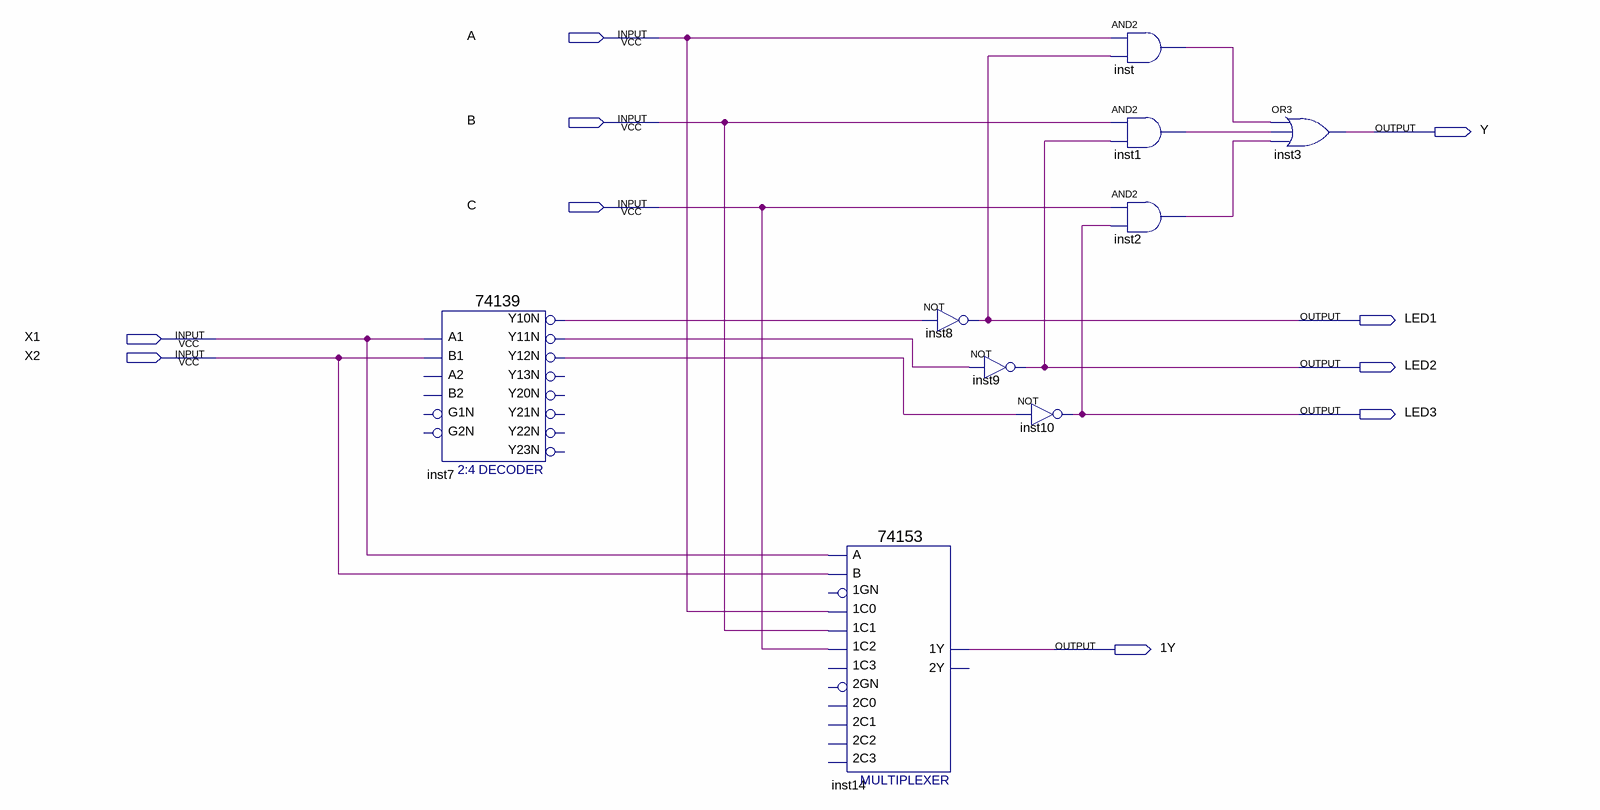
[diagram p0: schematic sheet]
// Quartus schematic Cmb3.bdf as structural Verilog: 9 symbols, 10 pins
module Cmb3 (
  input  A,
  input  B,
  input  C,
  input  X1,
  input  X2,
  output Y,
  output LED1,
  output LED2,
  output LED3,
  output \1Y 
);

  wire inst1_out, inst2_out, inst7_y10n, inst7_y11n, inst7_y12n, inst_out;

  \74139  inst7 (
    .A1(X1), .B1(X2), .Y10N(inst7_y10n), .Y12N(inst7_y12n), .Y11N(inst7_y11n));  // open: A2, B2, G1N, G2N, Y20N, Y13N, Y21N, Y22N, Y23N
  \74153  inst14 (
    .\1C1 (B), .\1C0 (A), .\1C2 (C), .B(X2), .A(X1), .\1Y (\1Y ));  // open: 1GN, 2C0, 2GN, 2C2, 1C3, 2C1, 2C3, 2Y
  not inst8 (LED1, inst7_y10n);
  not inst9 (LED2, inst7_y11n);
  not inst10 (LED3, inst7_y12n);
  and inst (inst_out, A, LED1);
  and inst1 (inst1_out, B, LED2);
  and inst2 (inst2_out, C, LED3);
  or inst3 (Y, inst_out, inst1_out, inst2_out);
endmodule
